# EAGLE schematic NQSMHS-V2.3 (EAGLE 5.10)

## Sheet 1 of 4
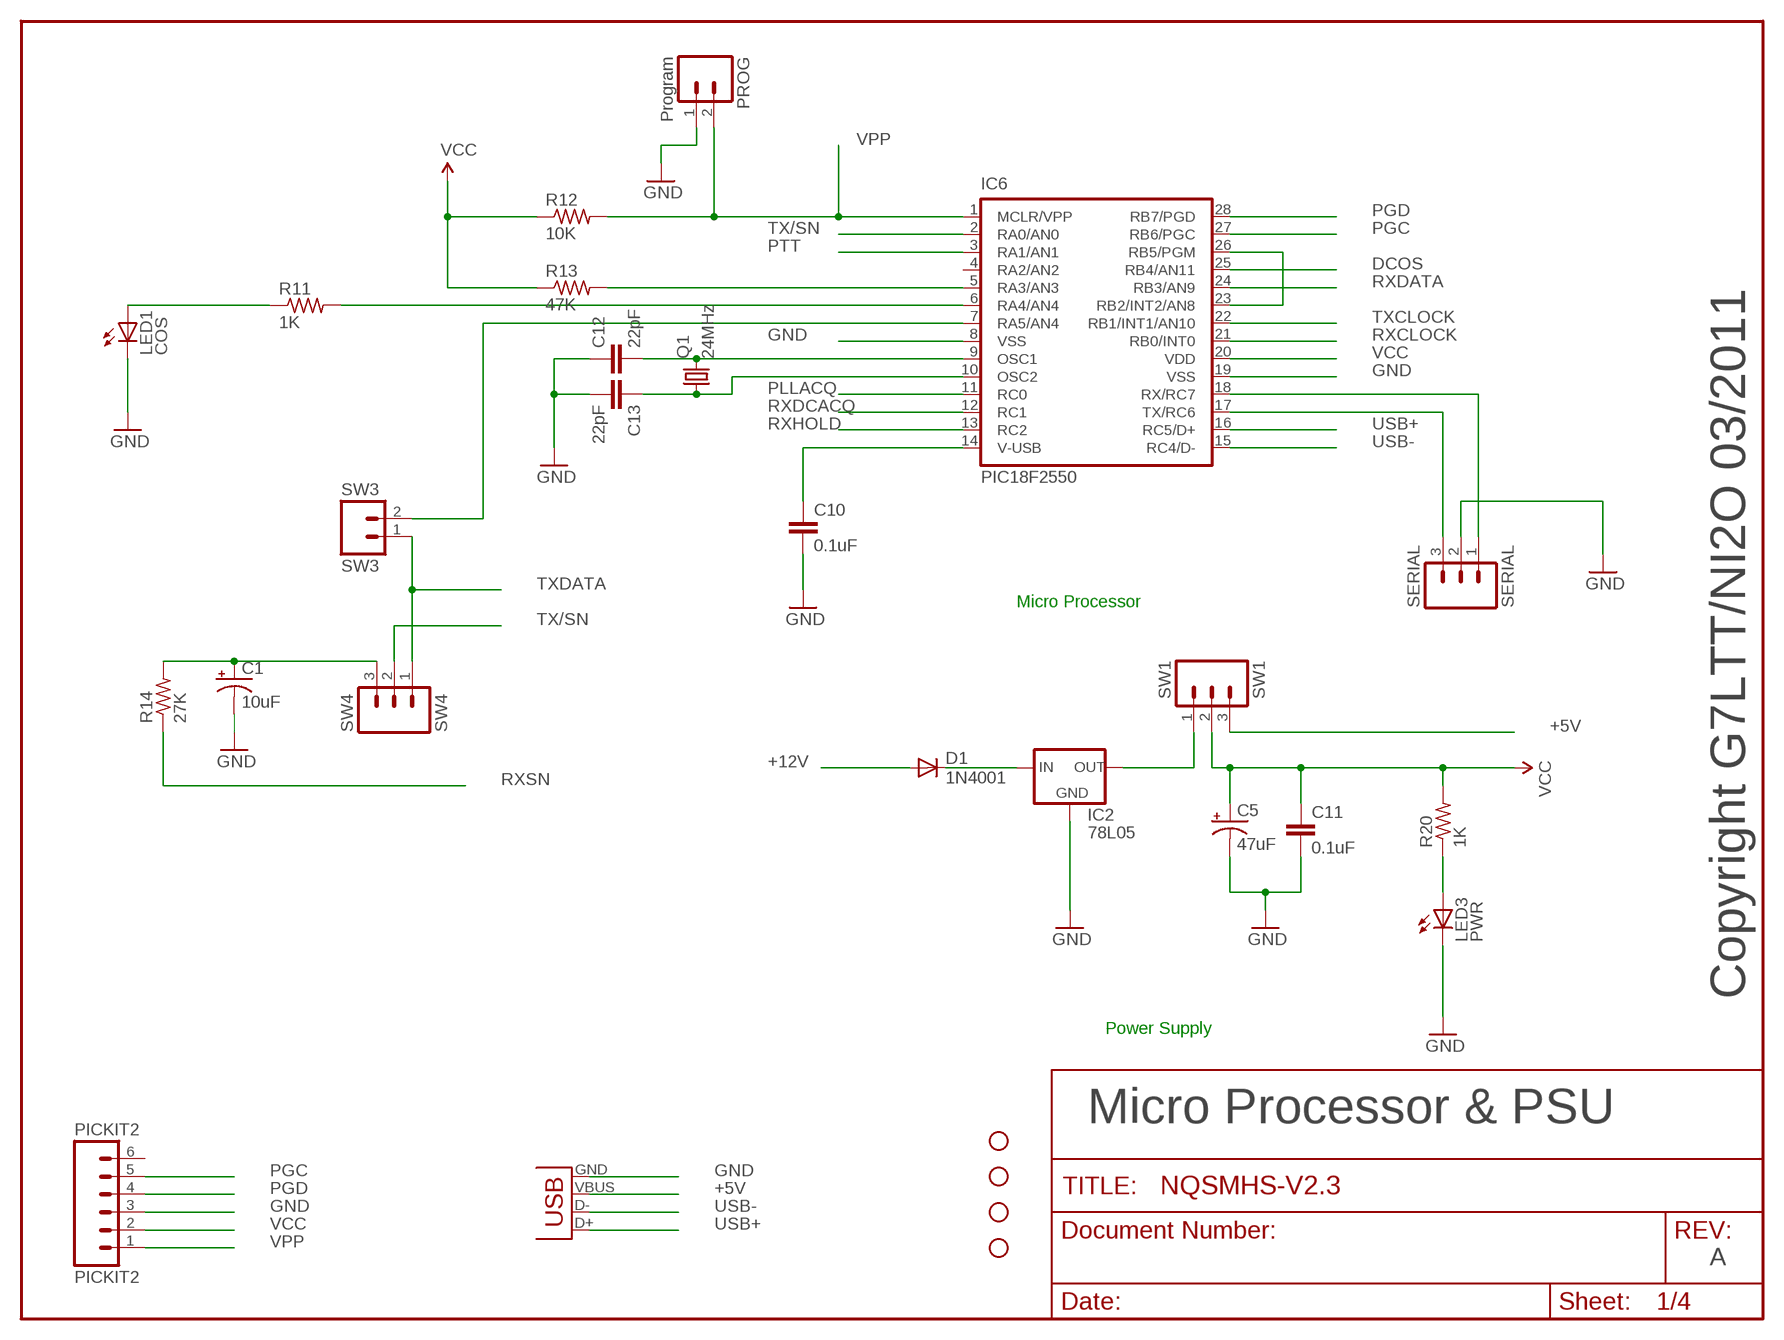
[diagram p0: schematic, sheet 1]

### Parts
C1  10uF  CAP_POLPTH2  [CPOL-RADIAL-10UF-25V]
C5  47uF  CAP_POLPTH2  [CPOL-RADIAL-10UF-25V]
C10  0.1uF  C2.5/2  [C2.5-2]
C11  0.1uF  C2.5/2  [C2.5-2]
C12  22pF  C2.5/2  [C2.5-2]
C13  22pF  C2.5/2  [C2.5-2]
D1  1N4001  DIODEPTH  [DIODE-1N4001]
IC2  78L05  78LXX  [78LXX]
IC6  PIC18F2550  [DIL28-3]
J1  USBPTH  [USB-B-PTH]
JP7  STAND-OFF  [STAND-OFF]
JP8  STAND-OFF  [STAND-OFF]
JP9  STAND-OFF  [STAND-OFF]
JP10  STAND-OFF  [STAND-OFF]
LED1  COS  LED5MM  [LED5MM]
LED3  PWR  LED5MM  [LED5MM]
PICKIT2  PICKIT2  M06SIP  [1X06]
PROG  Program  M02PTH  [1X02]
Q1  24MHz  CRYSTALHC49US  [HC49US]
R11  1K  R-US_0207/2V  [0207/2V]
R12  10K  R-US_0207/2V  [0207/2V]
R13  47K  R-US_0207/2V  [0207/2V]
R14  27K  R-US_0207/2V  [0207/2V]
R20  1K  R-US_0207/2V  [0207/2V]
SERIAL  SERIAL  M03PTH  [1X03]
SW1  SW1  M03PTH  [1X03]
SW3  SW3  M02PTH  [1X02]
SW4  SW4  M03PTH  [1X03]

### Nets
+5V: J1.VBUS SW1.3
+12V: D1.A ; also sheet 2
DCOS: IC6.25(RB4/AN11) ; also sheet 3
GND: C1.2(-) C5.2(-) C10.2 C11.2 C12.1 C13.2 IC2.GND IC6.8(VSS) IC6.19(VSS) J1.GND LED1.K(C) LED3.K(C) PICKIT2.3 PROG.1 SERIAL.2 ; also sheet 2,3,4
N$2: D1.C IC2.IN
N$3: IC6.23(RB2/INT2/AN8) IC6.26(RB5/PGM)
N$4: IC6.5(RA3/AN3) R13.2
N$5: IC6.6(RA4/AN4) R11.2
N$6: LED1.A R11.1
N$7: IC6.7(RA5/AN4) SW3.2
N$8: C1.1(+) R14.2 SW4.3
N$9: C12.2 IC6.9(OSC1) Q1.2
N$10: C13.1 IC6.10(OSC2) Q1.1
N$11: C10.1 IC6.14(V-USB)
N$12: IC2.OUT SW1.1
N$13: LED3.A R20.1
PGC: IC6.27(RB6/PGC) PICKIT2.5
PGD: IC6.28(RB7/PGD) PICKIT2.4
PLLACQ: IC6.11(RC0) ; also sheet 4
PTT: IC6.3(RA1/AN1) ; also sheet 2
RX-232: IC6.18(RX/RC7) SERIAL.1
RXCLOCK: IC6.21(RB0/INT0) ; also sheet 4
RXDATA: IC6.24(RB3/AN9) ; also sheet 4
RXDCACQ: IC6.12(RC1) ; also sheet 4
RXHOLD: IC6.13(RC2) ; also sheet 4
RXSN: R14.1 ; also sheet 3,4
TX-232: IC6.17(TX/RC6) SERIAL.3
TX/SN: IC6.2(RA0/AN0) SW4.2
TXCLOCK: IC6.22(RB1/INT1/AN10) ; also sheet 4
TXDATA: SW3.1 SW4.1 ; also sheet 4
USB+: IC6.16(RC5/D+) J1.D+
USB-: IC6.15(RC4/D-) J1.D-
VCC: C5.1(+) C11.1 IC6.20(VDD) PICKIT2.2 R12.1 R13.1 R20.2 SW1.2 ; also sheet 2,3,4
VPP: IC6.1(MCLR/VPP) PICKIT2.1 PROG.2 R12.2
Unconnected: IC6.4(RA2/AN2) PICKIT2.6

### Notes on the sheet
- Micro Processor
- Copyright G7LTT/NI2O 03/2011
- Power Supply
- Micro Processor & PSU
- A

## Sheet 2 of 4
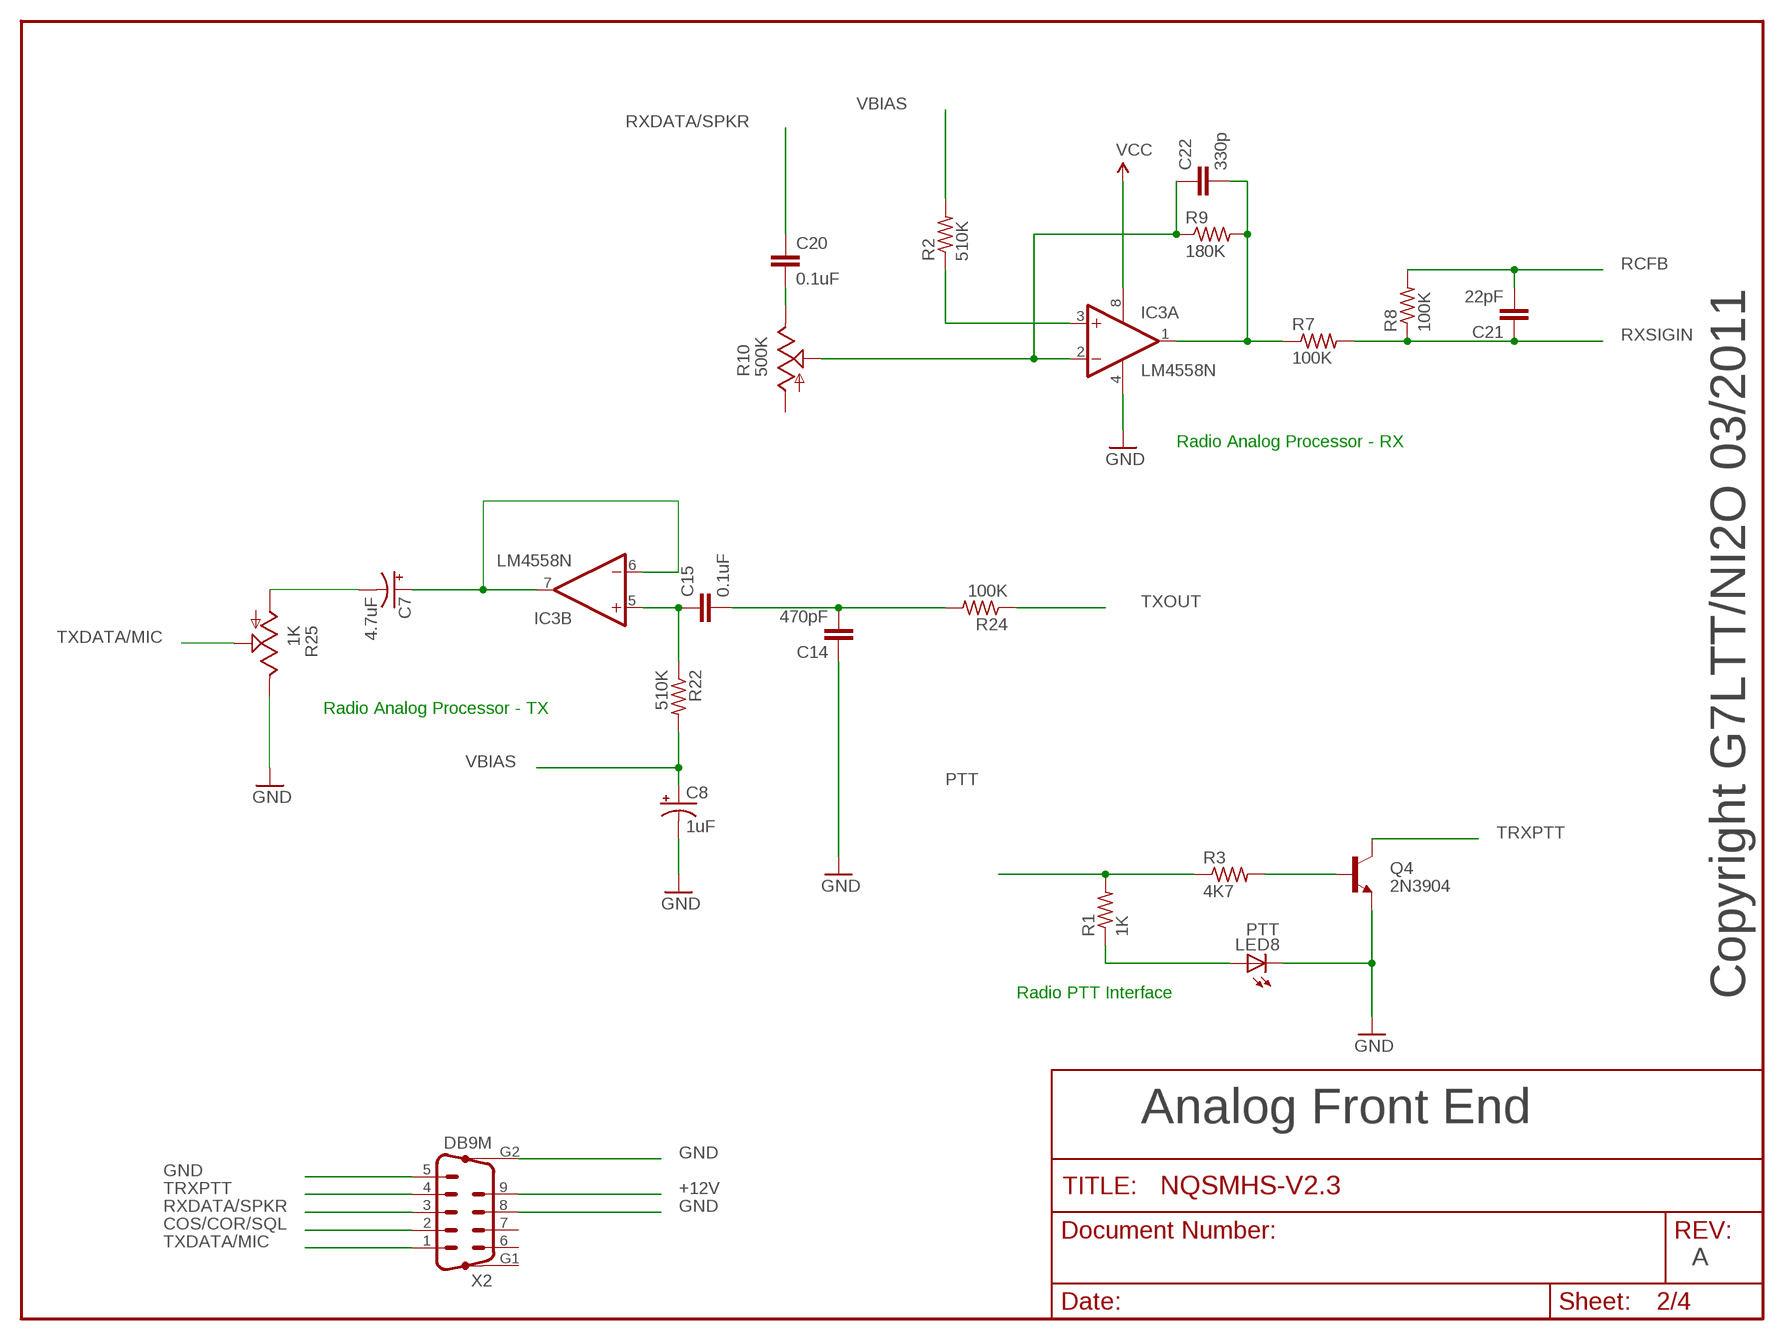
[diagram p1: schematic, sheet 2]

### Parts
C7  4.7uF  CAP_POLPTH2  [CPOL-RADIAL-10UF-25V]
C8  1uF  CAP_POLPTH2  [CPOL-RADIAL-10UF-25V]
C14  470pF  C2.5/2  [C2.5-2]
C15  0.1uF  C2.5/2  [C2.5-2]
C20  0.1uF  C2.5/2  [C2.5-2]
C21  22pF  C2.5/2  [C2.5-2]
C22  330p  C2.5/2  [C2.5-2]
IC3  LM4558N  [DIL08]
LED8  PTT  LED5MM  [LED5MM]
Q4  2N3904  TRANSISTOR_NPNTO92  [TO-92]
R1  1K  R-US_0207/2V  [0207/2V]
R2  510K  R-US_0207/2V  [0207/2V]
R3  4K7  R-US_0207/2V  [0207/2V]
R7  100K  R-US_0207/2V  [0207/2V]
R8  100K  R-US_0207/2V  [0207/2V]
R9  180K  R-US_0207/2V  [0207/2V]
R10  500K  TRIM_US-CA6V  [CA6V]
R22  510K  R-US_0207/2V  [0207/2V]
R24  100K  R-US_0207/2V  [0207/2V]
R25  1K  TRIM_US-CA6V  [CA6V]
X2  DB9M  M09HP  [M09HP]

### Nets
+12V: X2.9 ; also sheet 1
COS/COR/SQL: X2.2
GND: C8.2(-) C14.1 IC3.4(P:V-) LED8.K(C) Q4.1(E) R25.E X2.5 X2.8 X2.G2 ; also sheet 1,3,4
N$15: Q4.2(B) R3.2
N$17: LED8.A R1.1
N$18: C7.2(-) R25.A
N$19: C7.1(+) IC3.6(B:-IN) IC3.7(B:OUT)
N$23: C22.2 IC3.1(A:OUT) R7.1 R9.2
N$25: C15.1 IC3.5(B:+IN) R22.1
N$26: C22.1 IC3.2(A:-IN) R9.1 R10.S
N$27: C14.2 C15.2 R24.2
N$37: C20.2 R10.E
N$40: IC3.3(A:+IN) R2.1
PTT: R1.2 R3.1 ; also sheet 1
RCFB: C21.2 R8.2 ; also sheet 4
RXDATA/SPKR: C20.1 X2.3
RXSIGIN: C21.1 R7.2 R8.1 ; also sheet 4
TRXPTT: Q4.3(C) X2.4
TXDATA/MIC: R25.S X2.1
TXOUT: R24.1 ; also sheet 4
VBIAS: C8.1(+) R2.2 R22.2 ; also sheet 4
VCC: IC3.8(P:V+) ; also sheet 1,3,4
Unconnected: R10.A X2.6 X2.7 X2.G1

### Notes on the sheet
- Radio Analog Processor - RX
- Radio Analog Processor - TX
- Radio PTT Interface | Copyright G7LTT/NI2O 03/2011
- Analog Front End
- A

## Sheet 3 of 4
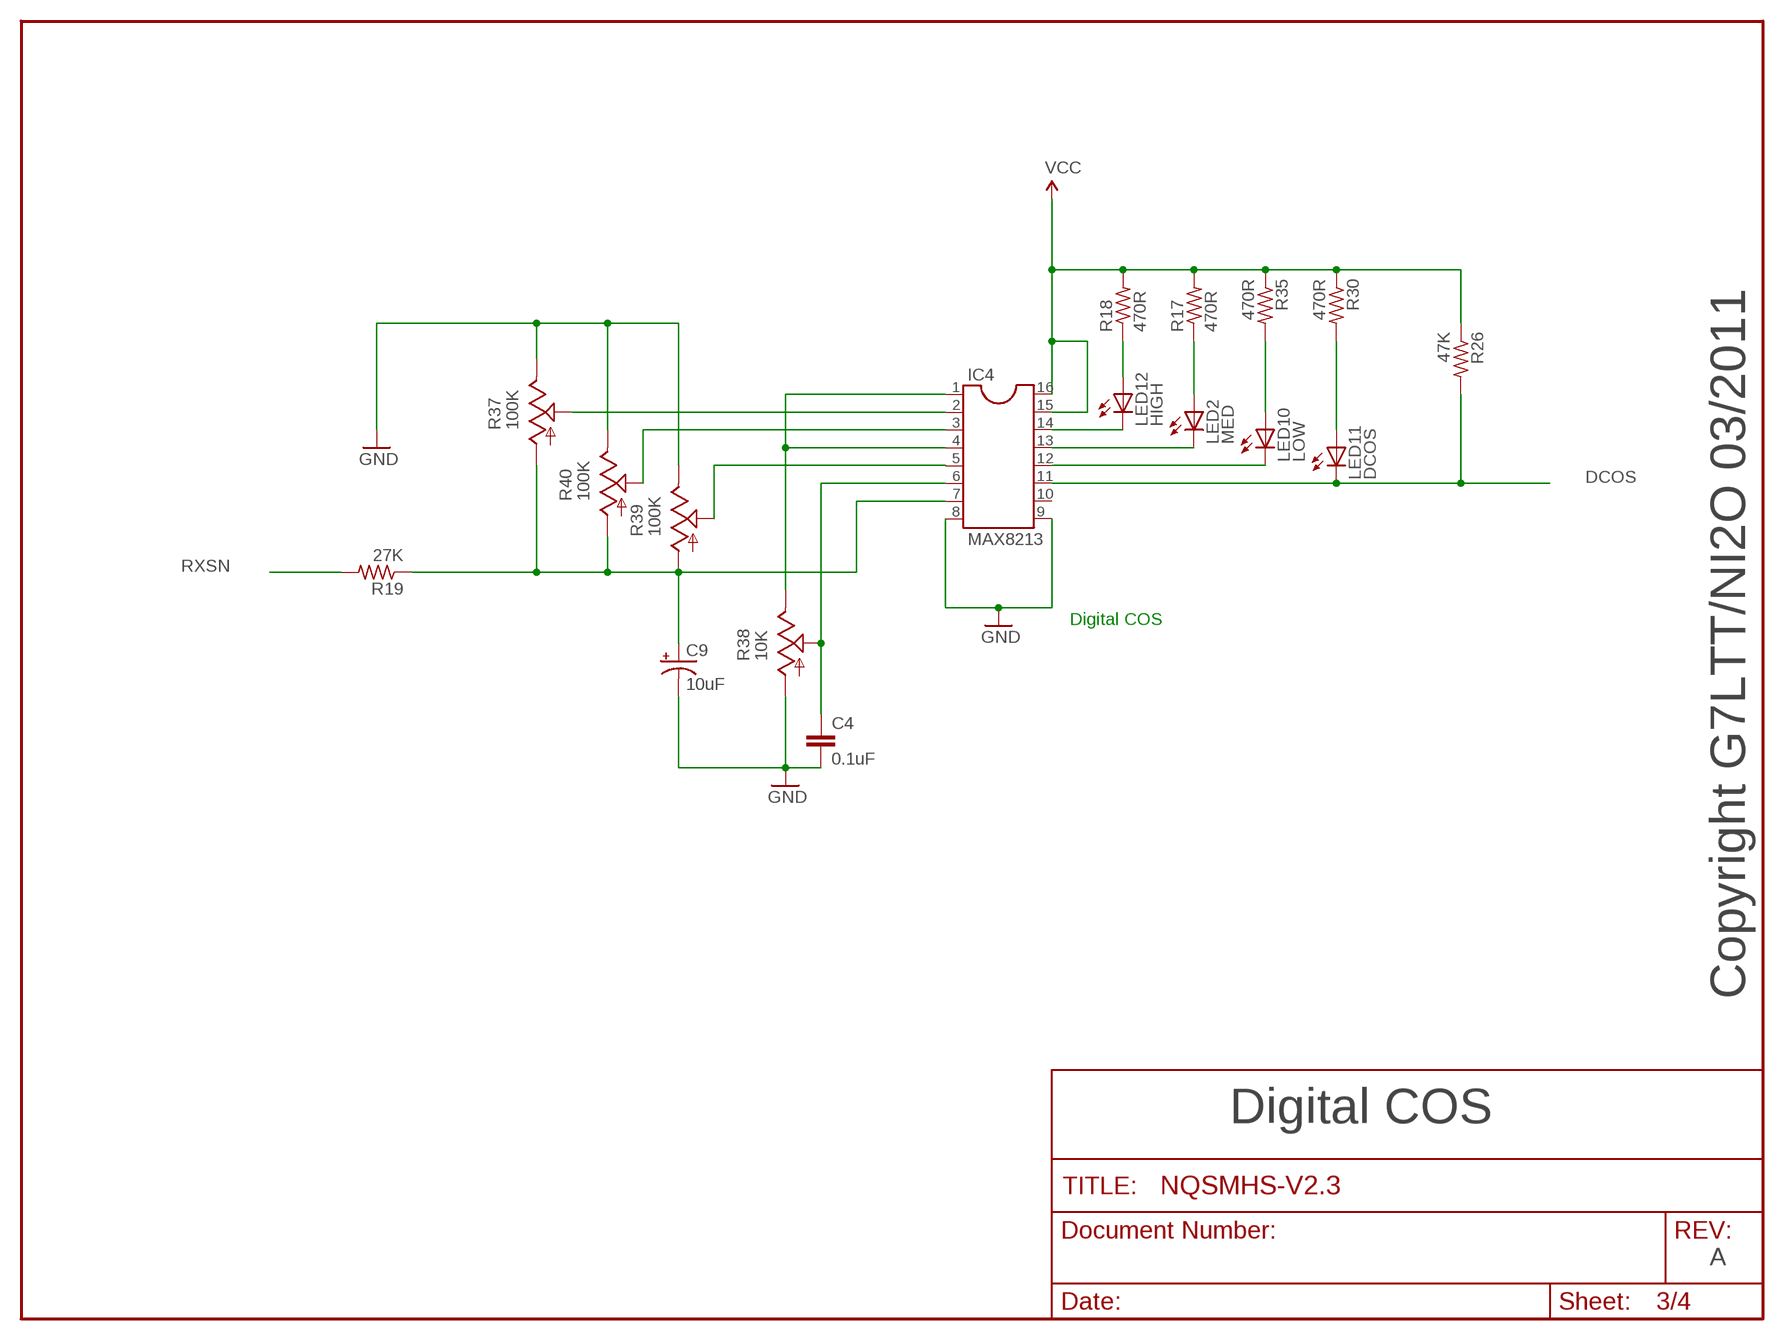
[diagram p2: schematic, sheet 3]

### Parts
C4  0.1uF  C2.5/2  [C2.5-2]
C9  10uF  CAP_POLPTH2  [CPOL-RADIAL-10UF-25V]
IC4  MAX8213  DIL16  [DIL16]
LED2  MED  LED5MM  [LED5MM]
LED10  LOW  LED5MM  [LED5MM]
LED11  DCOS  LED5MM  [LED5MM]
LED12  HIGH  LED5MM  [LED5MM]
R17  470R  R-US_0207/2V  [0207/2V]
R18  470R  R-US_0207/2V  [0207/2V]
R19  27K  R-US_0207/2V  [0207/2V]
R26  47K  R-US_0207/2V  [0207/2V]
R30  470R  R-US_0207/2V  [0207/2V]
R35  470R  R-US_0207/2V  [0207/2V]
R37  100K  TRIM_US-CA6V  [CA6V]
R38  10K  TRIM_US-CA6V  [CA6V]
R39  100K  TRIM_US-CA6V  [CA6V]
R40  100K  TRIM_US-CA6V  [CA6V]

### Nets
DCOS: IC4.11 LED11.K(C) R26.2 ; also sheet 1
GND: C4.2 C9.2(-) IC4.8 IC4.9 R37.E R38.A R39.E R40.E ; also sheet 1,2,4
N$14: C4.1 IC4.6 R38.S
N$16: IC4.14 LED12.K(C)
N$41: LED12.A R18.1
N$44: IC4.13 LED2.K(C)
N$45: LED2.A R17.1
N$46: IC4.12 LED10.K(C)
N$47: LED11.A R30.2
N$48: LED10.A R35.2
N$49: IC4.2 R37.S
N$50: IC4.3 R40.S
N$51: IC4.5 R39.S
N$52: IC4.1 IC4.4 R38.E
N$53: C9.1(+) IC4.7 R19.1 R37.A R39.A R40.A
RXSN: R19.2 ; also sheet 1,4
VCC: IC4.15 IC4.16 R17.2 R18.2 R26.1 R30.1 R35.1 ; also sheet 1,2,4
Unconnected: IC4.10

### Notes on the sheet
- Digital COS
- Copyright G7LTT/NI2O 03/2011
- Digital COS
- A

## Sheet 4 of 4
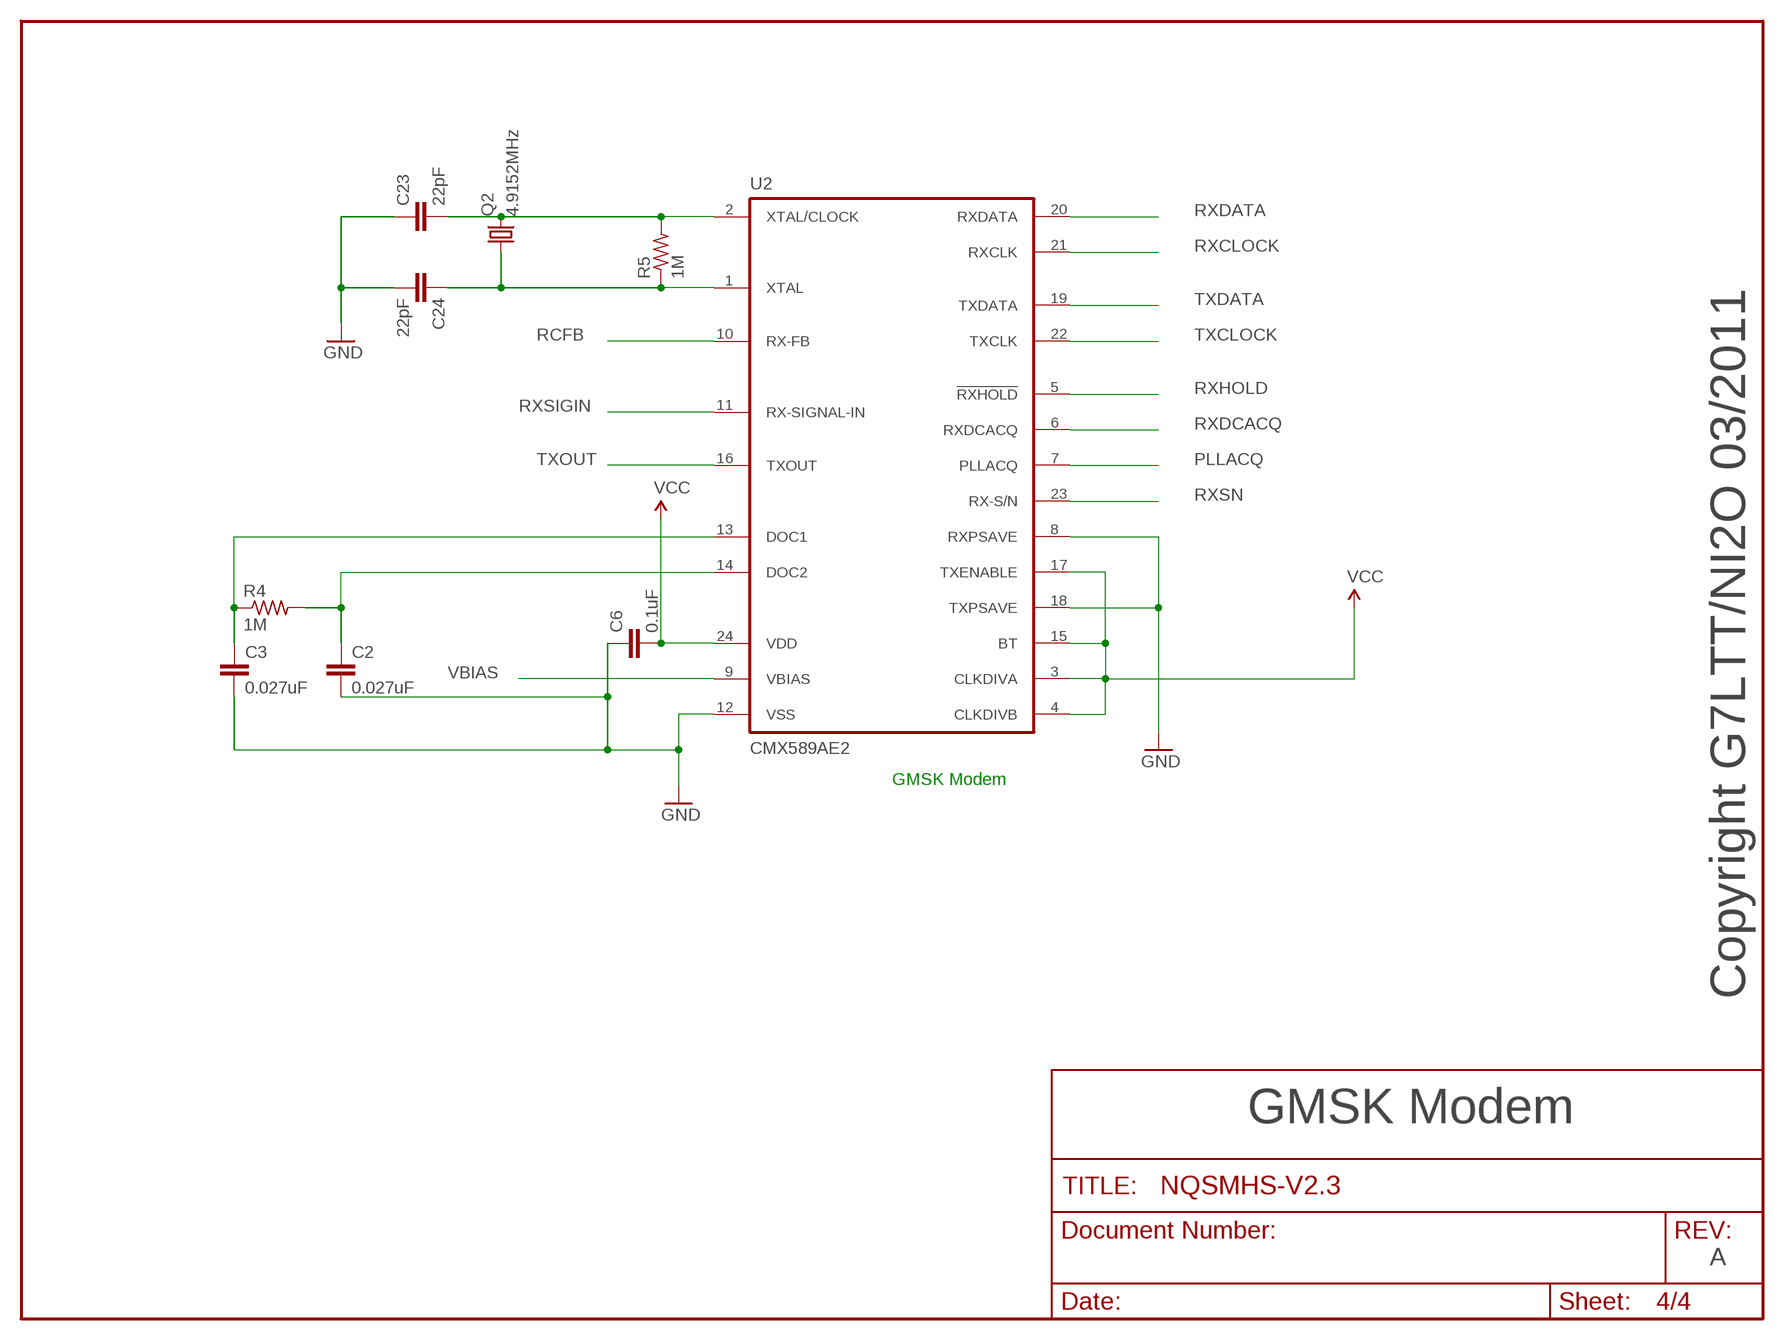
[diagram p3: schematic, sheet 4]

### Parts
C2  0.027uF  C2.5/2  [C2.5-2]
C3  0.027uF  C2.5/2  [C2.5-2]
C6  0.1uF  C2.5/2  [C2.5-2]
C23  22pF  C2.5/2  [C2.5-2]
C24  22pF  C2.5/2  [C2.5-2]
Q2  4.9152MHz  CRYSTALHC49US  [HC49US]
R4  1M  R-US_0207/2V  [0207/2V]
R5  1M  R-US_0207/2V  [0207/2V]
U2  CMX589AE2  [TSSOP24]

### Nets
GND: C2.2 C3.2 C6.1 C23.1 C24.2 U2.8(RXPSAVE) U2.12(VSS) U2.18(TXPSAVE) ; also sheet 1,2,3
N$1: C3.1 R4.1 U2.13(DOC1)
N$21: C2.1 R4.2 U2.14(DOC2)
N$22: C24.1 Q2.1 R5.1 U2.1(XTAL)
N$24: C23.2 Q2.2 R5.2 U2.2(XTAL/CLOCK)
PLLACQ: U2.7(PLLACQ) ; also sheet 1
RCFB: U2.10(RX-FB) ; also sheet 2
RXCLOCK: U2.21(RXCLK) ; also sheet 1
RXDATA: U2.20(RXDATA) ; also sheet 1
RXDCACQ: U2.6(RXDCACQ) ; also sheet 1
RXHOLD: U2.5(!RXHOLD!) ; also sheet 1
RXSIGIN: U2.11(RX-SIGNAL-IN) ; also sheet 2
RXSN: U2.23(RX-S/N) ; also sheet 1,3
TXCLOCK: U2.22(TXCLK) ; also sheet 1
TXDATA: U2.19(TXDATA) ; also sheet 1
TXOUT: U2.16(TXOUT) ; also sheet 2
VBIAS: U2.9(VBIAS) ; also sheet 2
VCC: C6.2 U2.3(CLKDIVA) U2.4(CLKDIVB) U2.15(BT) U2.17(TXENABLE) U2.24(VDD) ; also sheet 1,2,3

### Notes on the sheet
- GMSK Modem
- Copyright G7LTT/NI2O 03/2011
- GMSK Modem
- A

## Library data of the parts
C1 C5 C7-C9 = SparkFun:CAP_POL: Capacitor Polarized These are standard SMD and PTH capacitors. Normally 10uF, 47uF, and 100uF in electrolytic and tantalum varieties. Always verify the external diameter of the through hole cap, it varies with capacity, voltage, and manufacturer. The EIA devices should be standard.
C2-C4 C6 C10-C15 C20-C24 = capacitor-wima:C: CAPACITOR naming: grid - package width
D1 = SparkFun:DIODE: Diode These are standard reverse protection diodes and small signal diodes. SMA package can handle up to about 1A. SOD-323 can handle about 200mA. What the SOD-323 package when ordering, there are some mfgs out there that are 5-pin packages.
IC2 = v-reg:78LXX: VOLTAGE REGULATOR
IC3 = linear:*4558: OP AMP
IC4 = ic-package:DIL16: Dual In Line / Socket
IC6 = SparkFun:PIC18F2550
J1 = SparkFun:USB: USB Connectors USB-B-PTH is fully proven SKU : PRT-00139 USB-miniB is fully proven SKU : PRT-00587 USB-A-PCB is untested. USB-A-H is throughly reviewed, but untested. Spark Fun Electronics SKU : PRT-00437 USB-B-SMT is throughly reviewed, but untested. Needs silkscreen touching up. USB-A-S has not been used/tested USB-MB-H has not been used/tested
JP7-JP10 = SparkFun:STAND-OFF: Stand Off This is the mechanical footprint for a #4 phillips button head screw. Use the keepout ring to avoid running the screw head into surrounding components. SKU : PRT-00447
LED1-LED3 LED8 LED10-LED12 = SparkFun:LED: LEDs Standard schematic elements and footprints for 5mm, 3mm, 1206, and 0603 sized LEDs. 5mm - Spark Fun Electronics SKU : COM-00529 (and others)
PICKIT2 = SparkFun:M06: Header 6 Standard 6-pin 0.1" header. Use with straight break away headers (SKU : PRT-00116), right angle break away headers (PRT-00553), swiss pins (PRT-00743), machine pins (PRT-00117), and female headers (PRT-00115). Molex polarized connector foot print use with SKU : PRT-08094 with associated crimp pins and housings. NOTES ON THE VARIANTS LOCK and LOCK_LONGPADS... This footprint was designed to help hold the alignment of a through-hole component (i.e. 6-pin header) while soldering it into place. You may notice that each hole has been shifted either up or down by 0.005 of an inch from it's more standard position (which is a perfectly straight line). This slight alteration caused the pins (the squares in the middle) to touch the edges of the holes. Because they are alternating, it causes a "brace" to hold the component in place. 0.005 has proven to be the perfect amount of "off-center" position when using our standard breakaway headers. Although looks a little odd when you look at the bare footprint, once you have a header in there, the alteration is very hard to notice. Also, if you push a header all the way into place, it is covered up entirely on the bottom side. This idea of altering the position of holes to aid alignment will be further integrated into the Sparkfun Library for other footprints. It can help hold any component with 3 or more connection pins.
PROG SW3 = SparkFun:M02: Header 2 Standard 2-pin 0.1" header. Use with straight break away headers (SKU : PRT-00116), right angle break away headers (PRT-00553), swiss pins (PRT-00743), machine pins (PRT-00117), and female headers (PRT-00115). Molex polarized connector foot print use with SKU : PRT-08233 with associated crimp pins and housings.
Q1 Q2 = SparkFun:CRYSTAL: Crystals Various standard crystals. Proven footprints. Spark Fun Electronics SKU : COM-00534
Q4 = SparkFun:TRANSISTOR_NPN: Transistor NPN BJT configuration in SOT23 package. MMBT2222 is the common NPN we use. Double check BCE configuration again layout.
R1-R5 R7-R9 R11-R14 R17-R20 R22 R24 R26 R30 R35 = resistor:R-US_: RESISTOR, American symbol
R10 R25 R37-R40 = pot:TRIM_US-: POTENTIOMETER
SERIAL SW1 SW4 = SparkFun:M03: Header 3 Standard 3-pin 0.1" header. Use with straight break away headers (SKU : PRT-00116), right angle break away headers (PRT-00553), swiss pins (PRT-00743), machine pins (PRT-00117), and female headers (PRT-00115). Molex polarized connector foot print use with SKU : PRT-08232 with associated crimp pins and housings.
U2 = cml-micro:CMX589A: HIGH-SPEED GMSK MODEM
X2 = con-subd:M09HP: SUB-D